# EAGLE design nodEssentials.v1.cg2 (EAGLE 4.11)
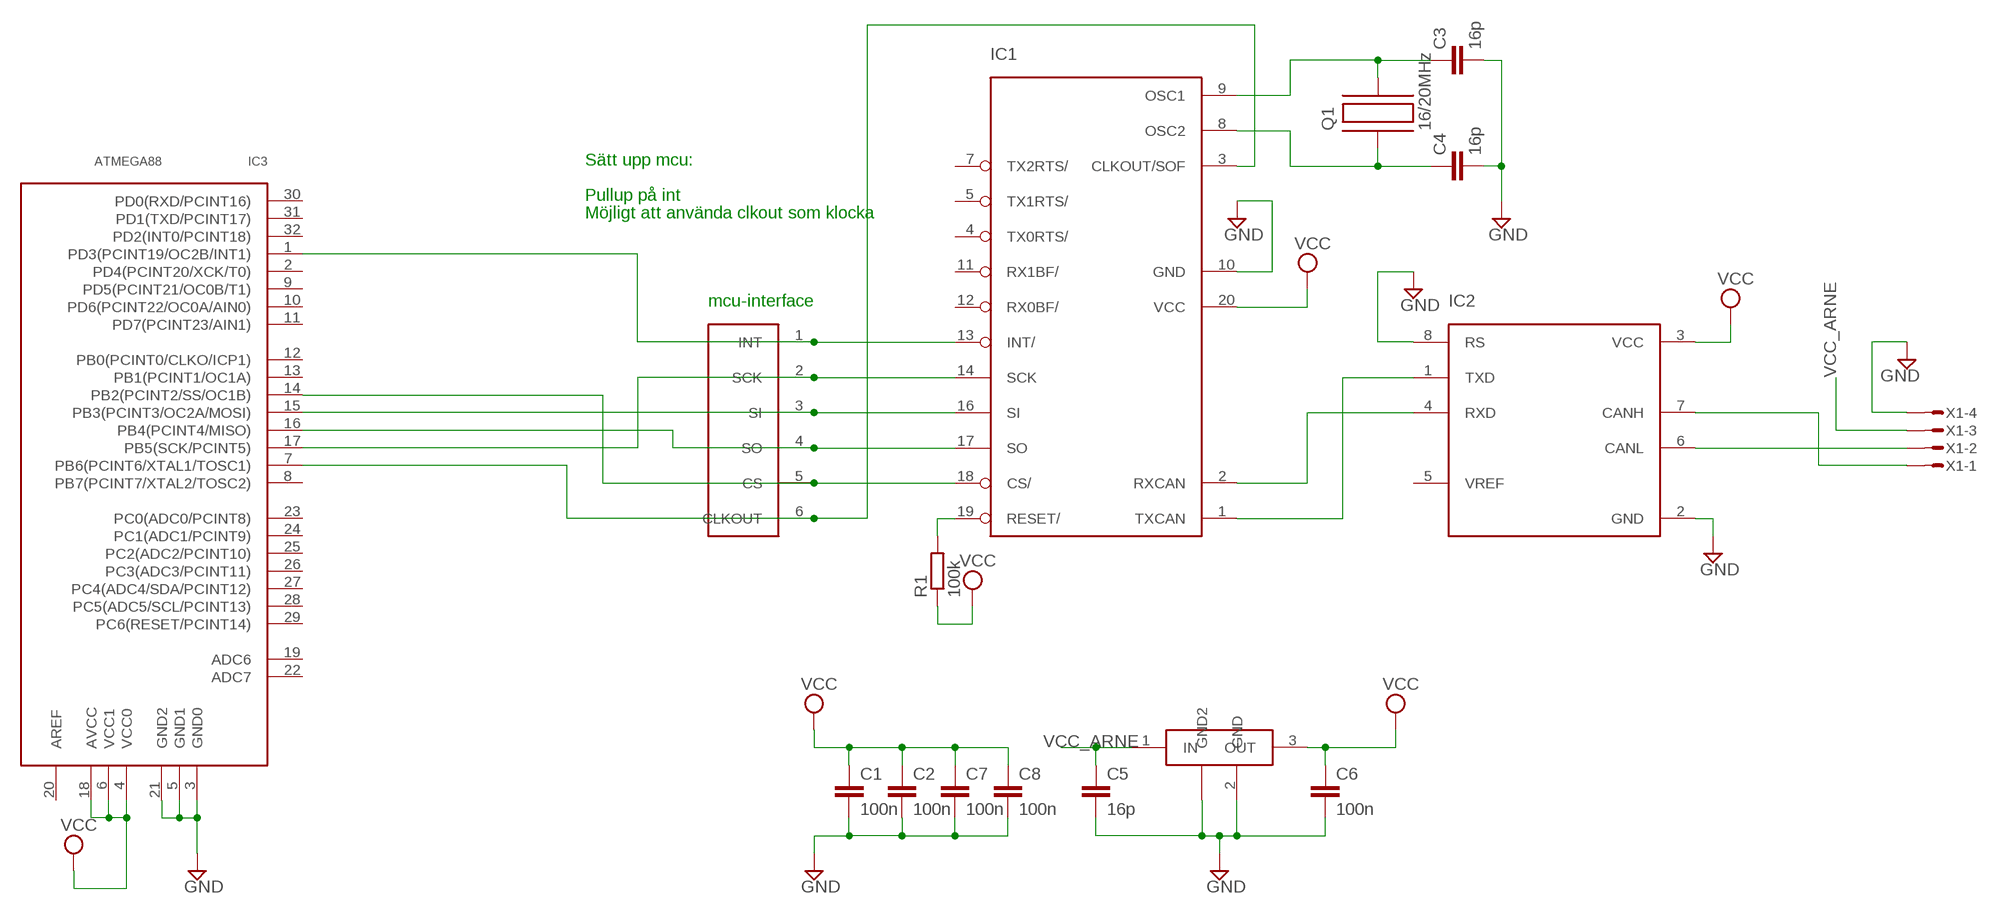
[diagram p0: schematic, sheet 1]

## Parts
C1  100n  C-EUC0603  [C0603]
C2  100n  C-EUC0603  [C0603]
C3  16p  C-EUC0603  [C0603]
C4  16p  C-EUC0603  [C0603]
C5  16p  C-EUC0603  [C0603]
C6  100n  C-EUC0603  [C0603]
C7  100n  C-EUC0603  [C0603]
C8  100n  C-EUC0603  [C0603]
IC1  MCP2515  [TSSOP]
IC2  MCP2551  [TSSOP]
IC3  ATMEGA88  [TQFP32]
LM340MP  LM340MP-5.0  [SOT223]
Q1  16/20MHz  C-MAC-LFA147E  [SMD]
R1  100k  R-EU_R0603  [R0603]
U$1  CAN-INTERFACE  [VIA-LIST]
X1  MICROMATCH-4  [MICROMATCH-4-SMD]

## Nets
CANH: IC2.7(CANH) X1.1
CANL: IC2.6(CANL) X1.2
GND: C1.2 C2.2 C3.2 C4.2 C5.2 C6.2 C7.2 C8.2 IC1.10(GND) IC2.2(GND) IC2.8(RS) IC3.3(GND0) IC3.5(GND1) IC3.21(GND2) LM340MP.2(GND) LM340MP.4(GND2) X1.4
N$1: IC1.2(RXCAN) IC2.4(RXD)
N$2: IC1.1(TXCAN) IC2.1(TXD)
N$4: IC1.13(INT/) IC3.1(PD3(PCINT19/OC2B/INT1)) U$1.1(INT)
N$10: IC1.19(RESET/) R1.2
N$12: C3.1 IC1.9(OSC1) Q1.P$2
N$13: C4.1 IC1.8(OSC2) Q1.P$1
N$20: IC1.14(SCK) IC3.17(PB5(SCK/PCINT5)) U$1.2(SCK)
N$21: IC1.16(SI) IC3.15(PB3(PCINT3/OC2A/MOSI)) U$1.3(SI)
N$22: IC1.17(SO) IC3.16(PB4(PCINT4/MISO)) U$1.4(SO)
N$23: IC1.3(CLKOUT/SOF) IC3.7(PB6(PCINT6/XTAL1/TOSC1)) U$1.6(CLKOUT)
N$29: IC1.18(CS/) IC3.14(PB2(PCINT2/SS/OC1B)) U$1.5(CS)
VCC: C1.1 C2.1 C6.1 C7.1 C8.1 IC1.20(VCC) IC2.3(VCC) IC3.4(VCC0) IC3.6(VCC1) IC3.18(AVCC) LM340MP.3(OUT) R1.1
VCC_ARNE: C5.1 LM340MP.1(IN) X1.3
Unconnected: IC1.4(TX0RTS/) IC1.5(TX1RTS/) IC1.7(TX2RTS/) IC1.11(RX1BF/) IC1.12(RX0BF/) IC2.5(VREF) IC3.2(PD4(PCINT20/XCK/T0)) IC3.8(PB7(PCINT7/XTAL2/TOSC2)) IC3.9(PD5(PCINT21/OC0B/T1)) IC3.10(PD6(PCINT22/OC0A/AIN0)) IC3.11(PD7(PCINT23/AIN1)) IC3.12(PB0(PCINT0/CLKO/ICP1)) IC3.13(PB1(PCINT1/OC1A)) IC3.19(ADC6) IC3.20(AREF) IC3.22(ADC7) IC3.23(PC0(ADC0/PCINT8)) IC3.24(PC1(ADC1/PCINT9)) IC3.25(PC2(ADC2/PCINT10)) IC3.26(PC3(ADC3/PCINT11)) IC3.27(PC4(ADC4/SDA/PCINT12)) IC3.28(PC5(ADC5/SCL/PCINT13)) IC3.29(PC6(RESET/PCINT14)) IC3.30(PD0(RXD/PCINT16)) IC3.31(PD1(TXD/PCINT17)) IC3.32(PD2(INT0/PCINT18))

## Notes on the sheet
- Sätt upp mcu:
- Pullup på int
- Möjligt att använda clkout som klocka
- mcu-interface

## Library data of the parts
C1-C8 = rcl:C-EU: CAPACITOR, European symbol
IC1 = mcp2515:MCP2515
IC2 = mcp2551:MCP2551
IC3 = atmega88:ATMEGA88
LM340MP = lm340mp:LM340MP-5.0
Q1 = hc49-4h-smx:C-MAC-LFA147E
R1 = rcl:R-EU_: RESISTOR, European symbol
U$1 = can-interface:CAN-INTERFACE
X1 = micromatch-smd:MICROMATCH-4: MicroMaTch 4 7-215464-4 / 0-215464-4 Drawing Number C-215464 DDEController.pdf

## Board
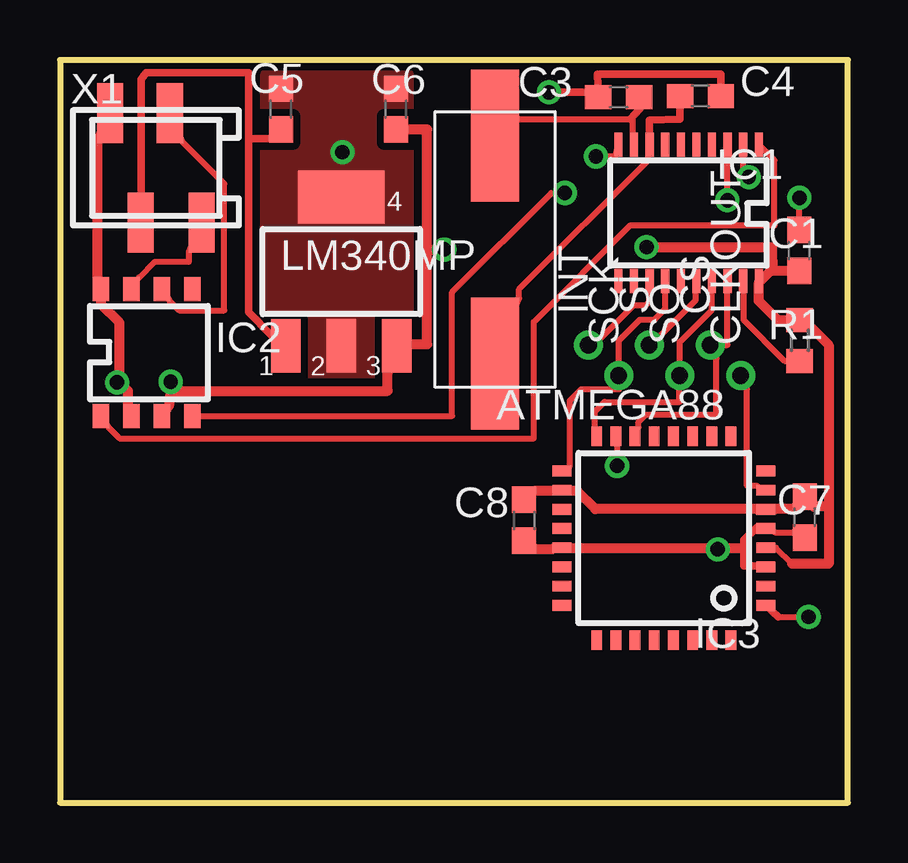
[diagram p1: board, top side]
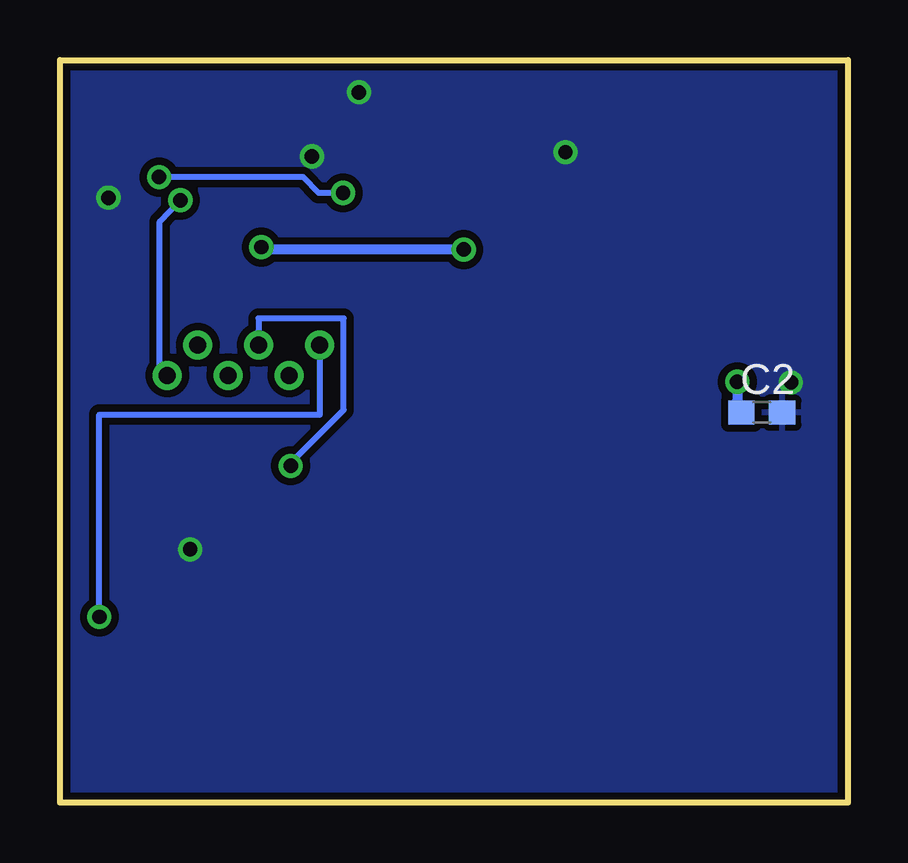
[diagram p2: board, bottom side, seen from below]

Size 32.85 x 30.97 mm. Coordinates in mm from the lower left corner, seen from the top.
Outline: 0,0 32.85,0 32.85,30.97 0,30.97 0,0
Copper layers (1*16): Top 0.035mm / dielectric 1.5mm / Bottom 0.035mm
Design rules "10mils, 0.6drill": minimum track width 10mil, minimum drill 0.6mm, track to track 10mil, track to pad 10mil, pad to pad 10mil, via to via 10mil, smd to smd 10mil, copper to edge 10mil, drill to drill 10mil, minimum pad ring 10mil, minimum via ring 8mil, stop-mask expansion 0mil, vias tented up to drill 0mil, thermal gap 10mil

### Footprints (pad centres in the part's own frame; a part is rotated, then mirrored left to right if it is on the bottom)
C0603 = smd 1.1 x 1: 1 -0.85,0; 2 0.85,0
TSSOP = smd 0.34 x 1: 1 -2.925,-2.85; 2 -2.275,-2.85; 3 -1.625,-2.85; 4 -0.975,-2.85; 5 -0.325,-2.85; 6 0.325,-2.85; 7 0.975,-2.85; 8 1.625,-2.85; 9 2.275,-2.85; 10 2.925,-2.85; 11 2.925,2.85; 12 2.275,2.85; 13 1.625,2.85; 14 0.975,2.85; 15 0.325,2.85; 16 -0.325,2.85; 17 -0.975,2.85; 18 -1.625,2.85; 19 -2.275,2.85; 20 -2.925,2.85
TSSOP' = smd 0.7 x 1: 1 -1.981,-2.645; 2 -0.711,-2.645; 3 0.559,-2.645; 4 1.829,-2.645; 5 1.829,2.645; 6 0.559,2.645; 7 -0.711,2.645; 8 -1.981,2.645
TQFP32 = smd 0.8 x 0.45: 1 -4.25,2.65; 2 -4.25,1.85; 3 -4.25,1.05; 4 -4.25,0.25; 5 -4.25,-0.55; 6 -4.25,-1.35; 7 -4.25,-2.15; 8 -4.25,-2.95; 17 4.25,-2.95; 18 4.25,-2.15; 19 4.25,-1.35; 20 4.25,-0.55; 21 4.25,0.25; 22 4.25,1.05; 23 4.25,1.85; 24 4.25,2.65 | smd 0.45 x 0.8: 9 -2.8,-4.4; 10 -2,-4.4; 11 -1.2,-4.4; 12 -0.4,-4.4; 13 0.4,-4.4; 14 1.2,-4.4; 15 2,-4.4; 16 2.8,-4.4; 25 2.8,4.1; 26 2,4.1; 27 1.2,4.1; 28 0.4,4.1; 29 -0.4,4.1; 30 -1.2,4.1; 31 -2,4.1; 32 -2.8,4.1
SOT223 = smd 1.219 x 2.235: 1 -2.311,-3.099; 2 0,-3.099; 3 2.311,-3.099 | smd 3.6 x 2.2: 4 0,3.099
SMD = smd 5.5 x 2: P$1 4.75,0; P$2 -4.75,0
R0603 = smd 1 x 1.1: 1 -0.85,0; 2 0.85,0
VIA-LIST = drill 0.7 round: 1 0,2.54; 2 -1.27,1.27; 3 0,0; 4 -1.27,-1.27; 5 0,-2.54; 6 -1.27,-3.81
MICROMATCH-4-SMD = smd 1.1 x 2.5: 1 1.905,-2.272; 2 0.585,2.272; 3 -0.635,-2.272; 4 -1.905,2.272

### Placement (x,y rotation side)
C1  30.82,23.03 90 top
C2  3.59,16.27 0 bottom
C3  23.29,29.42 180 top
C4  26.7,29.45 0 top
C5  9.22,28.92 90 top
C6  14.01,28.92 90 top
C7  31.04,11.9 270 top
C8  19.34,11.78 270 top
IC1  26.21,24.59 180 top
IC2  MCP2551  [TSSOP']  3.69,18.77 0 top
IC3  25.17,10.88 180 top
LM340MP  11.73,22.15 0 top
Q1  18.14,23.07 270 top
R1  30.84,19.28 270 top
U$1  24.57,19.09 90 top
X1  4,26.47 0 top

### Tracks (layer width: path | path; a pad name or v marks a point on that pad's centre or on a via)
CANH
  Top 0.254: IC2.7 3.29,21.9 3.95,22.56 5.38,22.56 5.38,22.96 X1.1
CANL
  Top 0.254: IC2.6 4.56,20.93 4.97,20.52 6.85,20.52 6.85,25.81 5.12,27.53 X1.2
GND  (via drill 0.6)
  Top 0.254: v22.34,26.95 23.16,26.95 IC1.10 | v30.83,25.22 30.83,24.36 C1.2 | 2.48,17.53 v2.38,17.53 | 20.56,10.59 IC3.21 21.28,10.62 | C8.2 19.8,10.59 | 29.05,9.88 IC3.3 | 29.05,11.48 IC3.5 29.81,11.28 30.57,11.28 C7.2 | 27.27,10.62 v27.42,10.57
  Top 0.305: IC2.2 2.84,16.56 | IC2.8 1.57,21.9 | C4.2 27.56,30.38 22.4,30.38 C3.2 22.15,29.62 v20.39,29.62 | 29.05,9.88 28.51,9.88 28.51,10.62 28.51,10.95 29.05,11.48
  Top 0.406: 2.84,16.56 2.84,17.17 2.48,17.53 2.48,20.02 1.72,20.78 IC2.8 | 1.57,21.9 1.57,27.53 X1.4 | 19.8,10.59 20.56,10.59 | 21.28,10.62 27.27,10.62 28.51,10.62
  Bottom 0.305: v20.39,29.62 20.34,29.57
  other vias: 11.78,27.12
  pour Bottom (isolate 0.305): -0.01,30.99 32.83,30.99 32.83,-0.03 24.38,-0.03 -0.01,-0.03
  pour Top (isolate 0.305, no thermals): 8.6,30.37 14.5,30.37 14.5,17.95 8.6,17.95
N$1  (via drill 0.6)
  Top 0.254: v21.05,25.43 20.49,25.43 16.35,21.29 16.35,16.13 5.83,16.13 IC2.4 | v28.72,26.09 28.49,26.31 IC1.2
  Bottom 0.254: v21.05,25.43 22.06,25.43 22.72,26.09 v28.72,26.09
N$2
  Top 0.254: IC2.1 2.02,15.65 2.48,15.19 19.75,15.19 19.75,20.04 23.79,24.08 29.79,24.08 29.79,26.79 IC1.1
N$4  (via drill 0.6)
  Top 0.254: U$1.1 22.25,19.09 23.92,20.75 24.43,20.75 24.58,20.91 24.58,21.62 IC1.13 | 29.94,7.75 v31.21,7.75
  Top 0.305: IC3.1 29.94,7.75
  Bottom 0.254: v31.21,7.75 31.21,16.18 22.01,16.18 22.01,19 22.02,19.01 U$1.1
N$10
  Top 0.254: R1.2 30.21,18.43 28.49,20.14 28.49,21.67 28.48,21.68 IC1.19
N$12
  Top 0.254: IC1.9 23.87,27.91 23.87,28.5 23.79,28.5 19.14,28.5 Q1.P$2
  Top 0.305: C3.1 24.17,28.94 23.79,28.5
N$13
  Top 0.254: IC1.8 24.53,26.95 24.53,26.8 19.14,21.41 19.14,21.03 Q1.P$1
  Top 0.305: IC1.8 24.58,28.46 25.85,28.49 C4.1
N$20
  Top 0.254: IC1.14 25.23,21.71 25.19,21.67 25.24,21.62 25.24,20.6 24.78,20.14 24.17,20.14 23.29,19.27 U$1.2 23.29,17.74 23.31,17.25 21.73,17.25 21.25,16.77 21.25,14.02 IC3.17
N$21  (via drill 0.6)
  Top 0.254: U$1.3 24.64,19.09 26.51,20.96 26.51,21.72 IC1.16 | v23.23,14.05 23.23,14.88 IC3.15
  Bottom 0.254: v23.23,14.05 23.23,14.17 21.02,16.38 21.02,20.19 24.58,20.19 24.58,19.69 U$1.3
N$22
  Top 0.254: IC1.17 27.18,21.68 27.17,21.67 27.17,20.55 25.84,19.21 U$1.4 25.84,17.74 25.82,16.71 22.7,16.71 22.29,16.31 22.29,15.6 IC3.16
N$23  (via drill 0.6)
  Top 0.254: v27.83,25.12 27.83,26.95 IC1.3 | IC3.7 29.05,13.21 28.64,13.21 28.64,17.25 U$1.6
  Bottom 0.254: v27.83,25.12 28.69,24.23 28.69,18.14 U$1.6
N$29
  Top 0.254: IC1.18 27.83,19.09 U$1.5 27.37,18.52 27.37,16.18 24.43,16.18 24.12,15.88 24.12,15.65 IC3.14
VCC  (via drill 0.6)
  Top 0.254: 29.12,21.64 29.15,21.72 IC1.20 | 29.59,22.15 29.69,22.17 29.76,22.18 | 4.61,17.09 4.67,17.17 | 29.81,12.24 IC3.6 29.05,12.24 | 21.28,13.01 IC3.18 | IC3.4 29.85,10.63 30.52,9.96
  Top 0.305: 13.66,17.93 LM340MP.3
  Top 0.406: C6.1 15.31,28.07 15.31,23.06 | 15.31,23.06 15.31,19.12 14.08,19.12 14.08,19.05 LM340MP.3 | 29.12,21.64 29.12,20.93 29.93,20.13 R1.1 31.33,19.79 32.05,19.08 32.05,12.34 | 29.76,22.18 C1.1 | 29.59,22.15 29.15,21.72 | 4.67,17.17 13.66,17.17 13.66,17.93 | IC2.3 4.56,16.61 4.61,17.09 v4.61,17.55 | 15.31,23.06 v16.02,23.06 | 29.69,22.17 29.68,23.16 29.68,23.17 v24.45,23.17 | IC3.18 20.56,13.01 19.8,13.01 C8.1 | 30.52,9.96 32.05,9.96 32.05,12.34 | 32.05,12.34 31.41,12.34 C7.1 30.57,12.24 29.81,12.24 | 21.28,13.01 21.56,13.01 22.32,12.24 29.05,12.24
  Bottom 0.254: 4.61,16.77 C2.1
  Bottom 0.406: v4.61,17.55 4.61,16.77 | v24.45,23.17 24.4,23.17 24.3,23.06 v16.02,23.06
VCC_ARNE
  Top 0.254: X1.3 3.4,25.4 | 7.86,27.79 7.86,27.69
  Top 0.305: C5.1 8.73,27.69 7.86,27.69 7.86,20.45 8.83,19.48 LM340MP.1 | 3.4,25.4 3.4,30.18 3.6,30.43 7.86,30.43 7.86,27.79